# Altium schematic sheet STM32F103CBT6_CORE.SchDoc
size A4; SheetNumber: 1; SheetTotal: 2
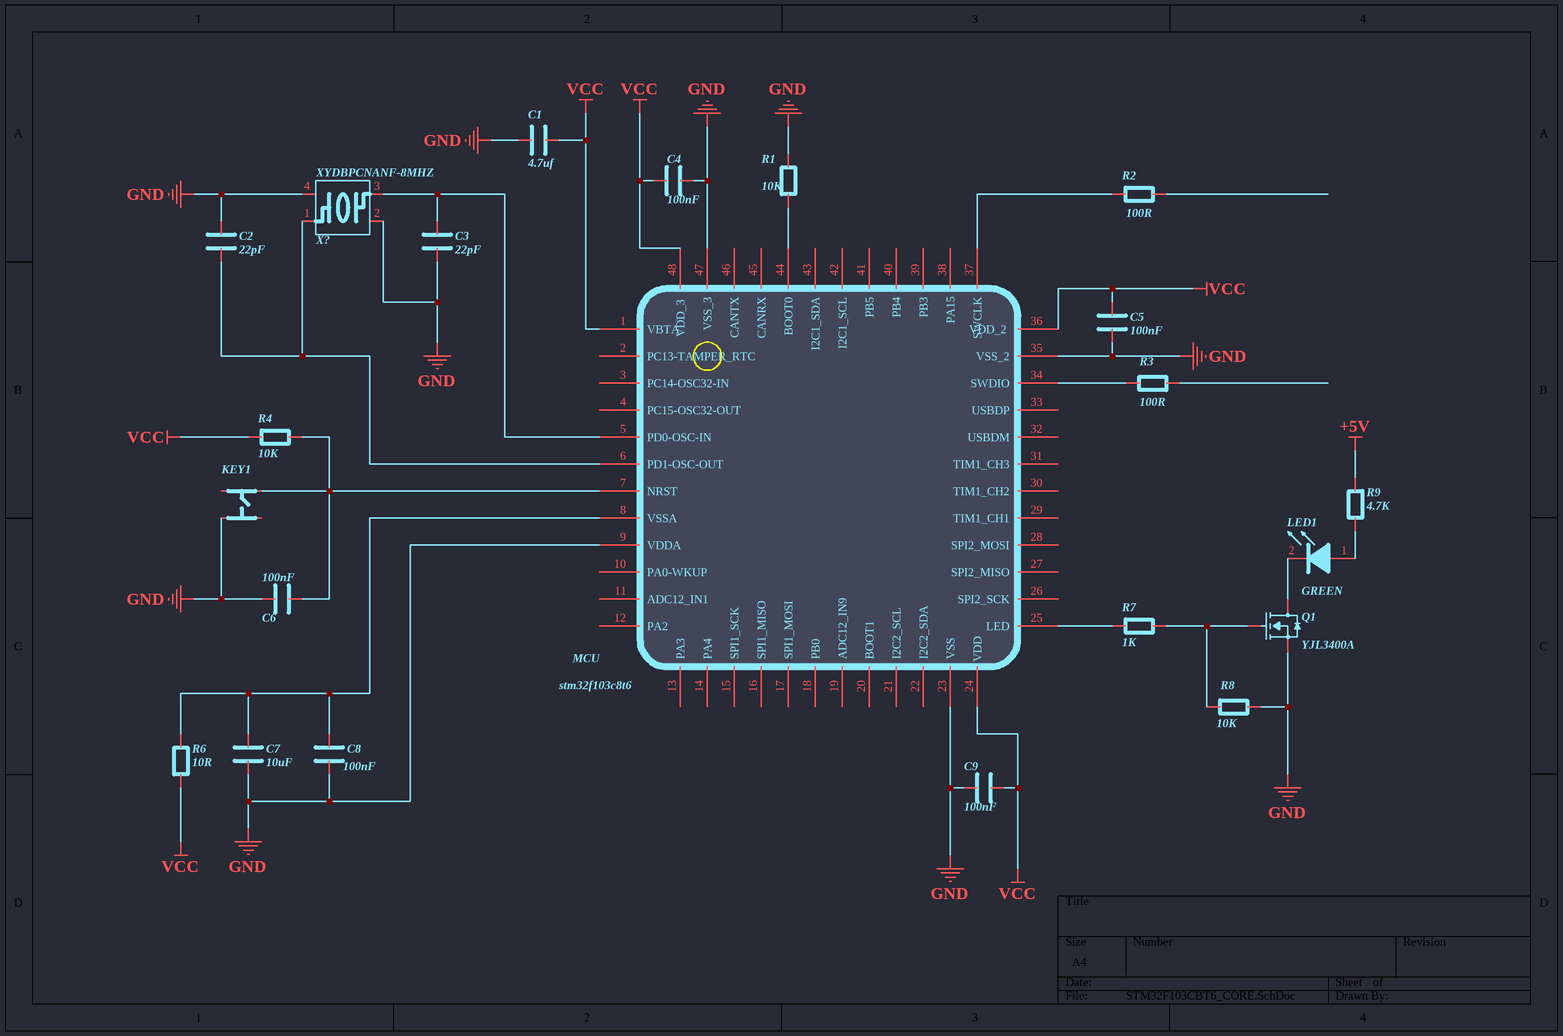
[diagram p0: STM32F103CBT6_CORE.SchDoc]

## Parts
C1  4.7uf  [CAP_0603]
C2  22pF  [CAP_0603]
C3  22pF  [CAP_0603]
C4  100nF  [CAP_0603]
C5  100nF  [CAP_0603]
C6  100nF  [CAP_0603]
C7  10uF  [CAP_0603]
C8  100nF  [CAP_0603]
C9  100nF  [CAP_0603]
KEY1  K1  [KEY-SMD_4P-L6.0-W6.0-P4.50-LS10.0]  (value not drawn)
LED1  GREEN  [LED_green]
MCU  stm32f103c8t6  [LQFP_48]
Q1  YJL3400A  [SOT23_3]
R1  10K  [RES_0603]
R2  100R  [RES_0603]
R3  100R  [RES_0603]
R4  10K  [RES_0603]
R6  10R  [RES_0603]
R7  1K  [RES_0603]
R8  10K  [RES_0603]
R9  4.7K  [RES_0603]
X?  XYDBPCNANF-8MHZ  [CARSTAL_4P_2520]

## Nets
+5V: R9.2
GND: C1.2 C2.1 C3.2 C4.2 C5.2 C6.2 C7.2 C8.2 C9.1 KEY1.3 MCU.9(VDDA) MCU.23(VSS) MCU.35(VSS_2) MCU.47(VSS_3) Q1.2(S) R1.1 R8.1 X?.2(GND) X?.4(GND)
VCC: C1.1 C4.1 C5.1 C9.2 MCU.1(VBTA) MCU.24(VDD) MCU.36(VDD_2) MCU.48(VDD_3) R4.2 R6.2
NetC2_2: C2.2 MCU.6(PD1-OSC-OUT) X?.1
NetC3_1: C3.1 MCU.5(PD0-OSC-IN) X?.3
NetC6_1: C6.1 KEY1.2 MCU.7(NRST) R4.1
NetC7_1: C7.1 C8.1 MCU.8(VSSA) R6.1
NetLED1_1: LED1.1(+) R9.1
NetLED1_2: LED1.2(-) Q1.3(D)
NetMCU_25: MCU.25(LED) R7.2
NetMCU_34: MCU.34(SWDIO) R3.1
NetMCU_37: MCU.37(SWCLK) R2.2
NetMCU_44: MCU.44(BOOT0) R1.2
NetQ1_1: Q1.1(G) R7.1 R8.2

Not connected (* = marked no-connect by the designer): KEY1 1 4; MCU 2(PC13-TAMPER_RTC) 3(PC14-OSC32-IN) 4(PC15-OSC32-OUT) 10(PA0-WKUP) 11(ADC12_IN1) 12(PA2) 13(PA3) 14(PA4) 15(SPI1_SCK) 16(SPI1_MISO) 17(SPI1_MOSI) 18(PB0) 19(ADC12_IN9) 20(BOOT1) 21(I2C2_SCL) 22(I2C2_SDA) 26(SPI2_SCK) 27(SPI2_MISO) 28(SPI2_MOSI) 29(TIM1_CH1) 30(TIM1_CH2) 31(TIM1_CH3) 32(USBDM) 33(USBDP) 38(PA15) 39(PB3) 40(PB4) 41(PB5) 42(I2C1_SCL) 43(I2C1_SDA) 45(CANRX) 46(CANTX); R2 1; R3 2

## Library data of the parts
C1-C5 C7-C9 = C: 电容
C6 = C
KEY1 = Button_4P: Button; type: TACT 4P
LED1 = LED: LED灯
MCU = stm32f103c8t6: STM32  MCU
Q1 = MOSFET_N: N_MOS
R1-R3 R6-R9 = R: 电阻
R4 = R
X? = Crystal_4P: 四脚无源晶振; Manufacturer: TAITIEN(泰艺电子); Symbol: XYDBPCNANF-12MHZ; Add into BOM: yes; Name: -; Device: XYDBPCNANF-12MHZ; Convert to PCB: yes; LCSC Part Name: 12MHz 12pF ±10ppm -20~+70℃; Supplier Part: C521567; Manufacturer Part: XYDBPCNANF-12MHZ; Supplier Footprint: SMD2520-4P; JLCPCB Part Class: 扩展库; Datasheet: https://atta.szlcsc.com/upload/public/pdf/source/20200427/C521567_8D8DDB0F2E066B5BAD7A5878EBE465E2.pdf; Supplier: LCSC; Crystal Type: -; Value: -; Frequency Tolerance: -; Frequency Stability: -; Load Capacitance: -; Operating Temperature: -